# EAGLE schematic slave (EAGLE 5.10)
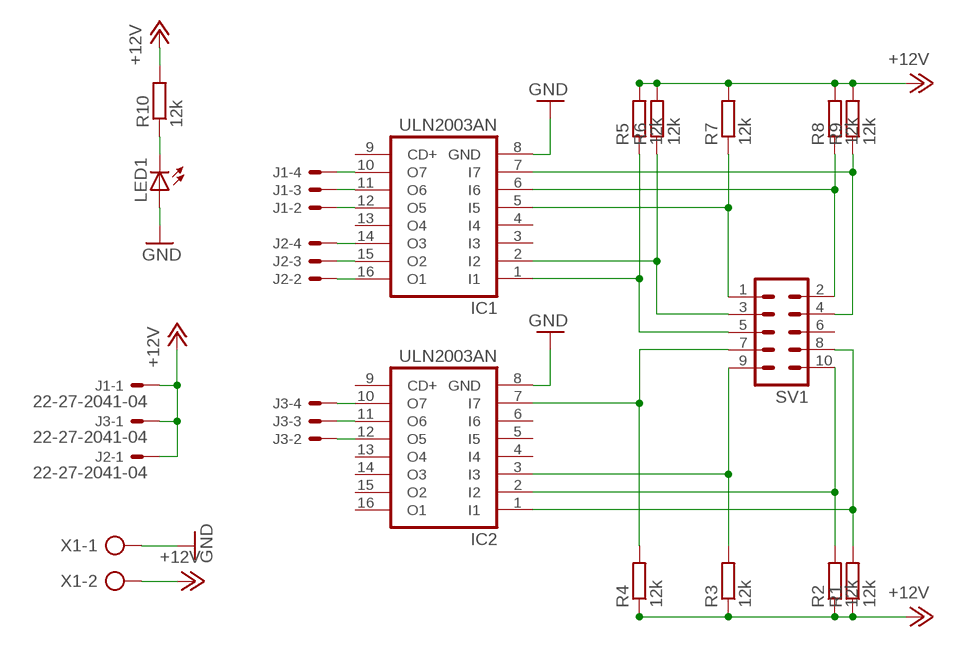
[diagram p0: schematic, sheet 1]

## Parts
IC1  ULN2003AN  [DIL16]
IC2  ULN2003AN  [DIL16]
J1  22-27-2041-04  [6410-04]
J2  22-27-2041-04  [6410-04]
J3  22-27-2041-04  [6410-04]
LED1  LEDCHIPLED_1206  [CHIPLED_1206]
R1  12k  R-EU_M1206  [M1206]
R2  12k  R-EU_M1206  [M1206]
R3  12k  R-EU_M1206  [M1206]
R4  12k  R-EU_M1206  [M1206]
R5  12k  R-EU_M1206  [M1206]
R6  12k  R-EU_M1206  [M1206]
R7  12k  R-EU_M1206  [M1206]
R8  12k  R-EU_M1206  [M1206]
R9  12k  R-EU_M1206  [M1206]
R10  12k  R-EU_M1206  [M1206]
SV1  ML10  [ML10]
X1  AK500/2  [AK500/2]

## Nets
+12V: J1.1 J2.1 J3.1 R1.1 R2.1 R3.1 R4.1 R5.2 R6.2 R7.2 R8.2 R9.2 R10.2 X1.2
GND: IC1.8(GND) IC2.8(GND) LED1.A X1.1
N$1: IC2.12(O5) J3.2
N$2: IC2.11(O6) J3.3
N$3: IC2.10(O7) J3.4
N$4: IC1.14(O3) J2.4
N$5: IC1.15(O2) J2.3
N$6: IC1.16(O1) J2.2
N$7: IC1.12(O5) J1.2
N$8: IC1.11(O6) J1.3
N$9: IC1.10(O7) J1.4
N$10: IC2.3(I3) R3.2 SV1.9
N$11: IC2.2(I2) R2.2 SV1.10
N$12: IC2.1(I1) R1.2 SV1.8
N$13: IC2.7(I7) R4.2 SV1.7
N$14: IC1.1(I1) R5.1 SV1.5
N$15: IC1.2(I2) R6.1 SV1.3
N$16: IC1.5(I5) R7.1 SV1.1
N$17: IC1.6(I6) R8.1 SV1.2
N$18: IC1.7(I7) R9.1 SV1.4
N$19: LED1.C R10.1
Unconnected: IC1.3(I3) IC1.4(I4) IC1.9(CD+) IC1.13(O4) IC2.4(I4) IC2.5(I5) IC2.6(I6) IC2.9(CD+) IC2.13(O4) IC2.14(O3) IC2.15(O2) IC2.16(O1) SV1.6

## Library data of the parts
IC1 IC2 = uln-udn:ULN2003A: DRIVER ARRAY
J1-J3 = con-molex:22-?-04: CONNECTOR wire to board 2.54 mm (.1 inch) pitch header; OC_FARNELL: unknown; OC_NEWARK: unknown
LED1 = led:LED: LED OSRAM: - CHIPLED LG R971, LG N971, LY N971, LG Q971, LY Q971, LO R971, LY R971 LH N974, LH R974 LS Q976, LO Q976, LY Q976 LO Q996 - Hyper CHIPLED LW Q18S LB Q993, LB Q99A, LB R99A - SideLED LS A670, LO A670, LY A670, LG A670, LP A670 LB A673, LV A673, LT A673, LW A673 LH A674 LY A675 LS A676, LA A676, LO A676, LY A676, LW A676 LS A679, LY A679, LG A679 - Hyper Micro SIDELED® LS Y876, LA Y876, LO Y876, LY Y876 LT Y87S - SmartLED LW L88C, LW L88S LB L89C, LB L89S, LG L890 LS L89K, LO L89K, LY L89K LS L896, LA L896, LO L896, LY L896 - TOPLED LS T670, LO T670, LY T670, LG T670, LP T670 LSG T670, LSP T670, LSY T670, LOP T670, LYG T670 LG T671, LOG T671, LSG T671 LB T673, LV T673, LT T673, LW T673 LH T674 LS T676, LA T676, LO T676, LY T676, LB T676, LH T676, LSB T676, LW T676 LB T67C, LV T67C, LT T67C, LS T67K, LO T67K, LY T67K, LW E67C LS E67B, LA E67B, LO E67B, LY E67B, LB E67C, LV E67C, LT E67C LW T67C LS T679, LY T679, LG T679 LS T770, LO T770, LY T770, LG T770, LP T770 LB T773, LV T773, LT T773, LW T773 LH T774 LS E675, LA E675, LY E675, LS T675 LS T776, LA T776, LO T776, LY T776, LB T776 LHGB T686 LT T68C, LB T68C - Hyper Mini TOPLED® LB M676 - Mini TOPLED Santana® LG M470 LS M47K, LO M47K, LY M47K Source: http://www.osram.convergy.de LUXEON: - LUMILED® LXK2-PW12-R00, LXK2-PW12-S00, LXK2-PW14-U00, LXK2-PW14-V00 LXK2-PM12-R00, LXK2-PM12-S00, LXK2-PM14-U00 LXK2-PE12-Q00, LXK2-PE12-R00, LXK2-PE12-S00, LXK2-PE14-T00, LXK2-PE14-U00 LXK2-PB12-K00, LXK2-PB12-L00, LXK2-PB12-M00, LXK2-PB14-N00, LXK2-PB14-P00, LXK2-PB14-Q00 LXK2-PR12-L00, LXK2-PR12-M00, LXK2-PR14-Q00, LXK2-PR14-R00 LXK2-PD12-Q00, LXK2-PD12-R00, LXK2-PD12-S00 LXK2-PH12-R00, LXK2-PH12-S00 LXK2-PL12-P00, LXK2-PL12-Q00, LXK2-PL12-R00 Source: www.luxeon.com KINGBRIGHT: KA-3528ASYC Source: www.kingbright.com
R1-R10 = rcl:R-EU_: RESISTOR, European symbol
SV1 = con-ml:ML10: HARTING; OC_FARNELL: unknown; OC_NEWARK: unknown
X1 = con-ptr500:AK500/2: CONNECTOR; OC_FARNELL: unknown; OC_NEWARK: unknown